# EAGLE design L298N MOTOR SÜRÜCÜ (EAGLE 9.6.2)
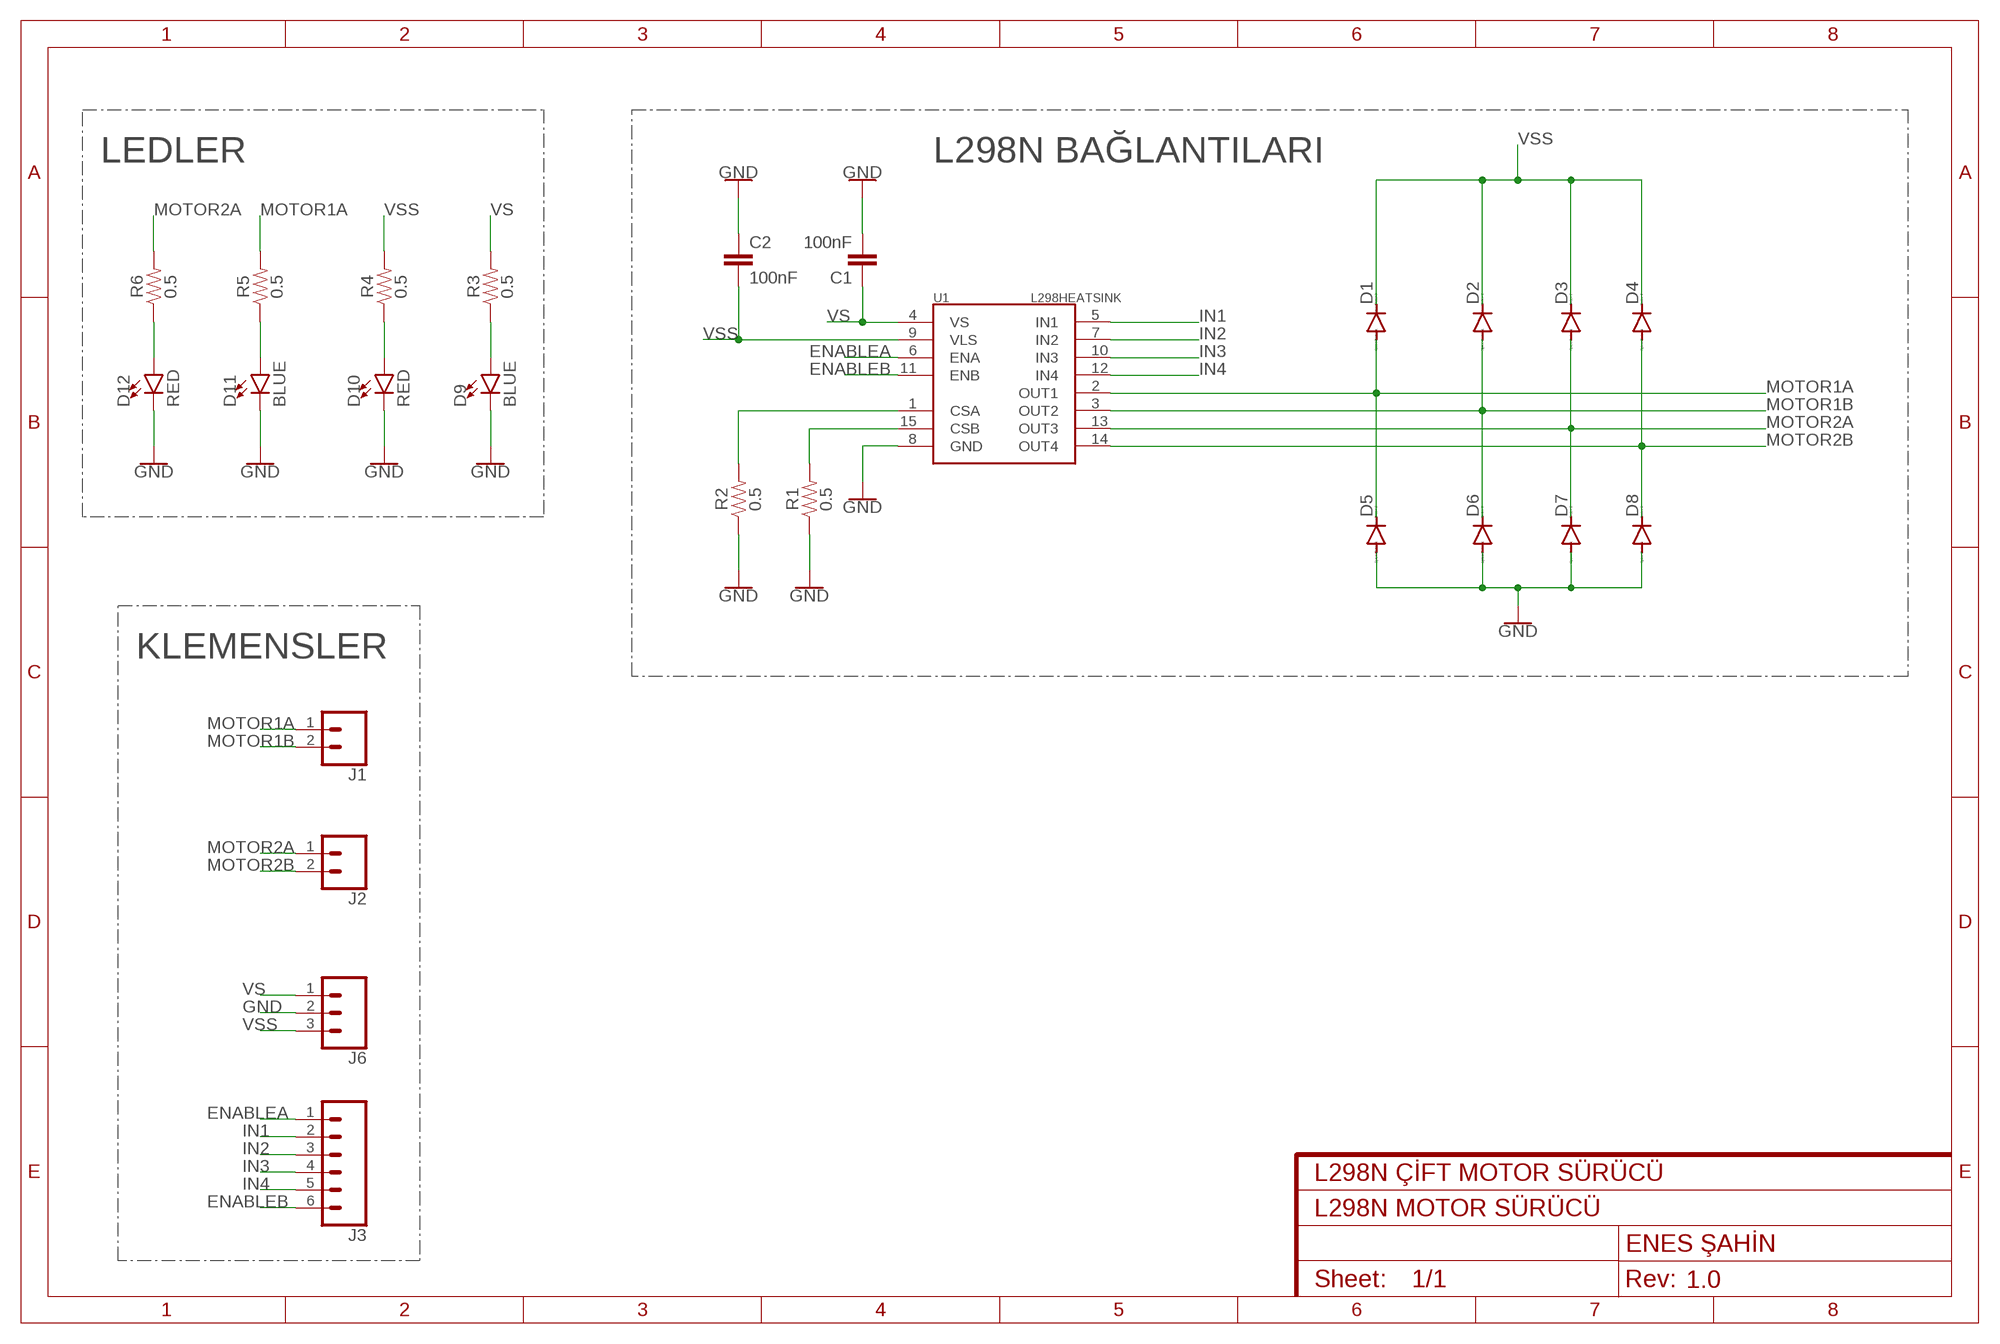
[diagram p0: schematic, sheet 1]
FRAME1 (FRAME-A4L): CNAME: L298N ÇİFT MOTOR SÜRÜCÜ; CREVISION: 1.0; DESIGNER: ENES ŞAHİN

## Parts
C1  100nF  10NF-0603-50V-10%  [0603]
C2  100nF  10NF-0603-50V-10%  [0603]
D1  CGRM4007-G  [SOD-123_MINI-SMA]
D2  CGRM4007-G  [SOD-123_MINI-SMA]
D3  CGRM4007-G  [SOD-123_MINI-SMA]
D4  CGRM4007-G  [SOD-123_MINI-SMA]
D5  CGRM4007-G  [SOD-123_MINI-SMA]
D6  CGRM4007-G  [SOD-123_MINI-SMA]
D7  CGRM4007-G  [SOD-123_MINI-SMA]
D8  CGRM4007-G  [SOD-123_MINI-SMA]
D9  BLUE  LED-BLUE0603  [LED-0603]
D10  RED  LED-RED0603  [LED-0603]
D11  BLUE  LED-BLUE0603  [LED-0603]
D12  RED  LED-RED0603  [LED-0603]
J1  CONN_02  [1X02]
J2  CONN_02  [1X02]
J3  CONN_06SILK_FEMALE_PTH  [1X06]
J6  CONN_03  [1X03]
R1  0.5  0.05OHM-0603-1/5W-1%  [0603]
R2  0.5  0.05OHM-0603-1/5W-1%  [0603]
R3  0.5  0.05OHM-0603-1/5W-1%  [0603]
R4  0.5  0.05OHM-0603-1/5W-1%  [0603]
R5  0.5  0.05OHM-0603-1/5W-1%  [0603]
R6  0.5  0.05OHM-0603-1/5W-1%  [0603]
U1  L298HEATSINK  [MULTIWATT15_6400BGHEATSINK]

## Nets
ENABLEA: J3.1 U1.6(ENA)
ENABLEB: J3.6 U1.11(ENB)
GND: C1.2 C2.1 D5.A D6.A D7.A D8.A D9.C D10.C D11.C D12.C J6.2 R1.1 R2.1 U1.8(GND)
IN1: J3.2 U1.5(IN1)
IN2: J3.3 U1.7(IN2)
IN3: J3.4 U1.10(IN3)
IN4: J3.5 U1.12(IN4)
MOTOR1A: D1.A D5.C J1.1 R5.2 U1.2(OUT1)
MOTOR1B: D2.A D6.C J1.2 U1.3(OUT2)
MOTOR2A: D3.A D7.C J2.1 R6.2 U1.13(OUT3)
MOTOR2B: D4.A D8.C J2.2 U1.14(OUT4)
N$1: R1.2 U1.15(CSB)
N$2: R2.2 U1.1(CSA)
N$3: D10.A R4.1
N$4: D9.A R3.1
N$5: D12.A R6.1
N$6: D11.A R5.1
VS: C1.1 J6.1 R3.2 U1.4(VS)
VSS: C2.2 D1.C D2.C D3.C D4.C J6.3 R4.2 U1.9(VLS)

## Notes on the sheet
- LEDLER | L298N BAĞLANTILARI
- KLEMENSLER

## Library data of the parts
C1 C2 = SparkFun-Capacitors:10NF: 0.01uF/10nF/10,000pF ceramic capacitors A capacitor is a passive two-terminal electrical component used to store electrical energy temporarily in an electric field. CAP-09321; PROD_ID: CAP-00867; VALUE: 10nF
D1-D8 = diode:CGRM400*-G: Molded plasitc,JEDEC SOD-123/Mini SMA Source: Comchip CGRM4001-G.pdf
D9 D11 = SparkFun-LED:LED-BLUE: Blue SMD LED Used in manufacturing of various products at SparkFun Packages: 0603 - SMD 0603 package [Product Link] <http://www.digikey.com/product-detail/en/SMLE12BC7TT86/511-1589-2-ND/1641808> 1206 - SMD1206 package [Product Link] <http://www.digikey.com/product-detail/en/lite-on-inc/LTST-C150TBKT/160-1643-1-ND/573584> SparkFun Products: ESP8266 Thing-Dev Board <https://www.sparkfun.com/products/13711> RedBoard <https://www.sparkfun.com/products/12757>; PROD_ID: DIO-08575
D10 D12 = SparkFun-LED:LED-RED: Red SMD LED Used in manufacturing of most products at SparkFun Packages: 0603 - SMD 0603 package [Product Link] <http://docs.avagotech.com/docs/AV02-0551EN> 0603 SMART - SMD 0603 SMART package ( more efficient and expensive)[Product Link] <http://www.osram-os.com/Graphics/XPic2/00077099_0.pdf> 1206 - SMD1206 package [Product Link] <https://www.sparkfun.com/datasheets/DevTools/LilyPad/Q150OVS4.pdff> SparkFun Products: Pro Mini 328 -5V <https://www.sparkfun.com/products/821> RedBoard <https://www.sparkfun.com/products/12757> IOIO-OTG <https://www.sparkfun.com/products/13613>; PROD_ID: DIO-00819
J1 J2 = SparkFun-Connectors:CONN_02: Multi connection point. Often used as Generic Header-pin footprint for 0.1 inch spaced/style header connections On any of the 0.1 inch spaced packages, you can populate with these: Break Away Headers - Straight <https://www.sparkfun.com/products/116> (PRT-00116) Break Away Male Headers - Right Angle <https://www.sparkfun.com/products/553> (PRT-00553) Female Headers <https://www.sparkfun.com/products/115> (PRT-00115) Break Away Headers - Machine Pin <https://www.sparkfun.com/products/117> (PRT-00117) Break Away Female Headers - Swiss Machine Pin <https://www.sparkfun.com/products/743> (PRT-00743) For SCREWTERMINALS and SPRING TERMINALS visit here: Screw Terimnals on SparkFun.com <https://www.sparkfun.com/search/results?term=Screw+Terminals> (5mm/3.5mm/2.54mm spacing) This device is also useful as a general connection point to wire up your design to another part of your project. Our various solder wires solder well into these plated through hole pads. Hook-Up Wire - Assortment (Stranded, 22 AWG) <https://www.sparkfun.com/products/11375> (PRT-11375) Hook-Up Wire - Assortment (Solid Core, 22 AWG) <https://www.sparkfun.com/products/11367> (PRT-11367) View the entire wire category on our website here <https://www.sparkfun.com/categories/141> Special notes: Molex polarized connector foot print use with: PRT-08233 with associated crimp pins and housings. 2.54_SCREWTERM for use with PRT-10571. 3.5mm Screw Terminal footprints for PRT-08084 5mm Screw Terminal footprints for use with PRT-08432
J3 = SparkFun-Connectors:CONN_06: Multi connection point. Often used as Generic Header-pin footprint for 0.1 inch spaced/style header connections On any of the 0.1 inch spaced packages, you can populate with these: Break Away Headers - Straight <https://www.sparkfun.com/products/116> (PRT-00116) Break Away Male Headers - Right Angle <https://www.sparkfun.com/products/553> (PRT-00553) Female Headers <https://www.sparkfun.com/products/115> (PRT-00115) Break Away Headers - Machine Pin <https://www.sparkfun.com/products/117> (PRT-00117) Break Away Female Headers - Swiss Machine Pin <https://www.sparkfun.com/products/743> (PRT-00743) Arduino Stackable Header - 6 Pin <https://www.sparkfun.com/products/9280> (PRT-09280) For SCREWTERMINALS and SPRING TERMINALS visit here: Screw Terimnals on SparkFun.com <https://www.sparkfun.com/search/results?term=Screw+Terminals> (5mm/3.5mm/2.54mm spacing) This device is also useful as a general connection point to wire up your design to another part of your project. Our various solder wires solder well into these plated through hole pads. Hook-Up Wire - Assortment (Stranded, 22 AWG) <https://www.sparkfun.com/products/11375> (PRT-11375) Hook-Up Wire - Assortment (Solid Core, 22 AWG) <https://www.sparkfun.com/products/11367> (PRT-11367) View the entire wire category on our website here <https://www.sparkfun.com/categories/141>; PROD_ID: CONN-08437
J6 = SparkFun-Connectors:CONN_03: Multi connection point. Often used as Generic Header-pin footprint for 0.1 inch spaced/style header connections On any of the 0.1 inch spaced packages, you can populate with these: Break Away Headers - Straight <https://www.sparkfun.com/products/116> (PRT-00116) Break Away Male Headers - Right Angle <https://www.sparkfun.com/products/553> (PRT-00553) Female Headers <https://www.sparkfun.com/products/115> (PRT-00115) Break Away Headers - Machine Pin <https://www.sparkfun.com/products/117> (PRT-00117) Break Away Female Headers - Swiss Machine Pin <https://www.sparkfun.com/products/743> (PRT-00743) Stackable Header - 3 Pin (Female, 0.1") <https://www.sparkfun.com/products/13875> (PRT-13875) For SCREWTERMINALS and SPRING TERMINALS visit here: Screw Terimnals on SparkFun.com <https://www.sparkfun.com/search/results?term=Screw+Terminals> (5mm/3.5mm/2.54mm spacing) This device is also useful as a general connection point to wire up your design to another part of your project. Our various solder wires solder well into these plated through hole pads. Hook-Up Wire - Assortment (Stranded, 22 AWG) <https://www.sparkfun.com/products/11375> (PRT-11375) Hook-Up Wire - Assortment (Solid Core, 22 AWG) <https://www.sparkfun.com/products/11367> (PRT-11367) View the entire wire category on our website here <https://www.sparkfun.com/categories/141> Special notes: Molex polarized connector foot print use with SKU : PRT-08232 with associated crimp pins and housings.
R1-R6 = SparkFun-Resistors:0.05OHM: 0.05Ω resistor A resistor is a passive two-terminal electrical component that implements electrical resistance as a circuit element. Resistors act to reduce current flow, and, at the same time, act to lower voltage levels within circuits. - Wikipedia; PROD_ID: RES-12535; VALUE: 0.05
U1 = SparkFun-IC-Special-Function:L298: L298 Dual Full Bridge Driver

## Board
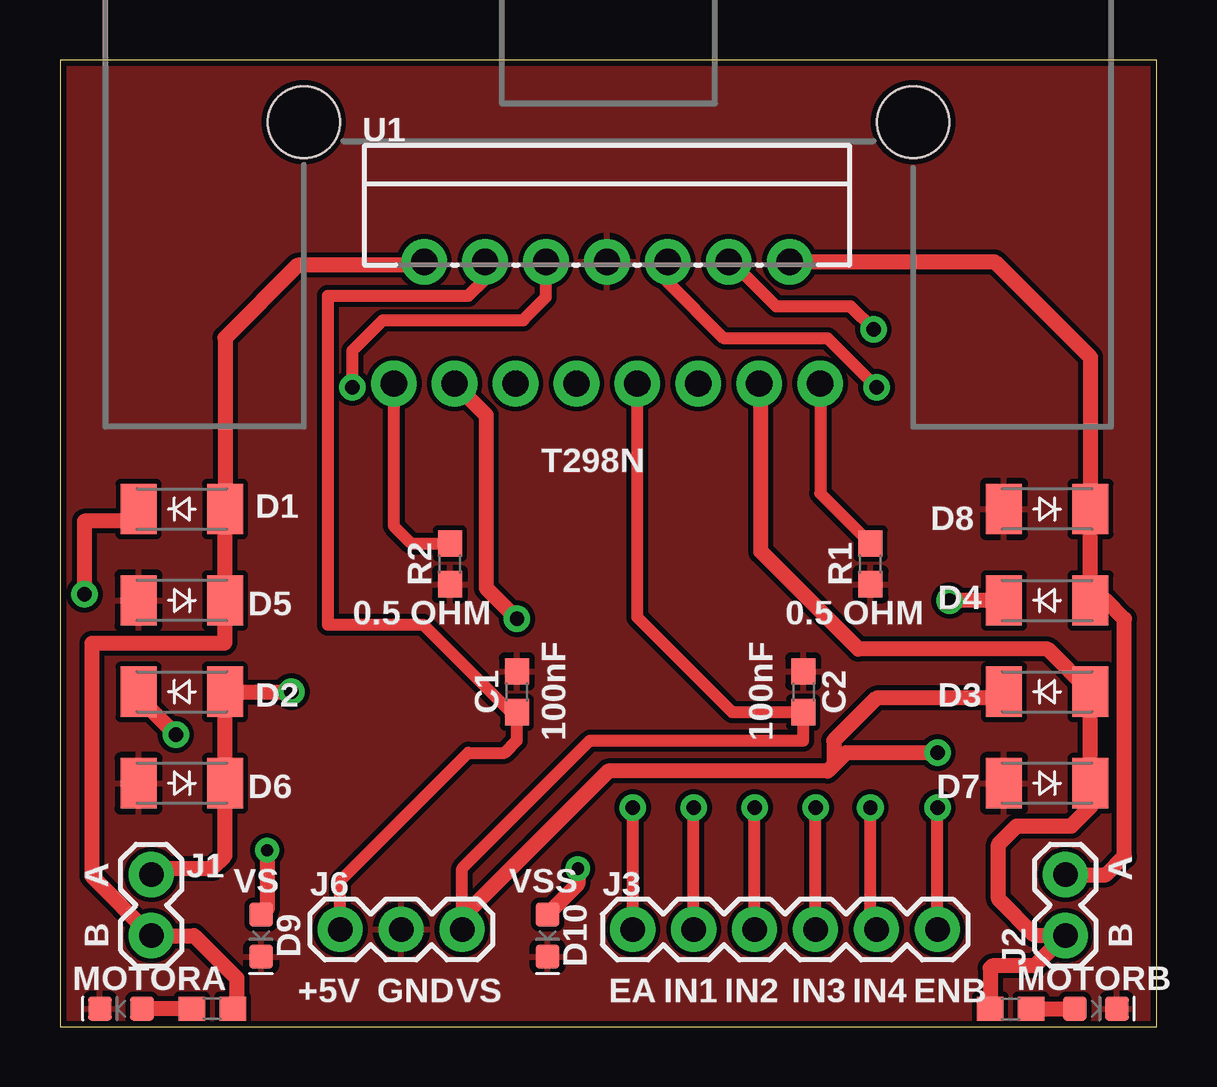
[diagram p1: board, top side]
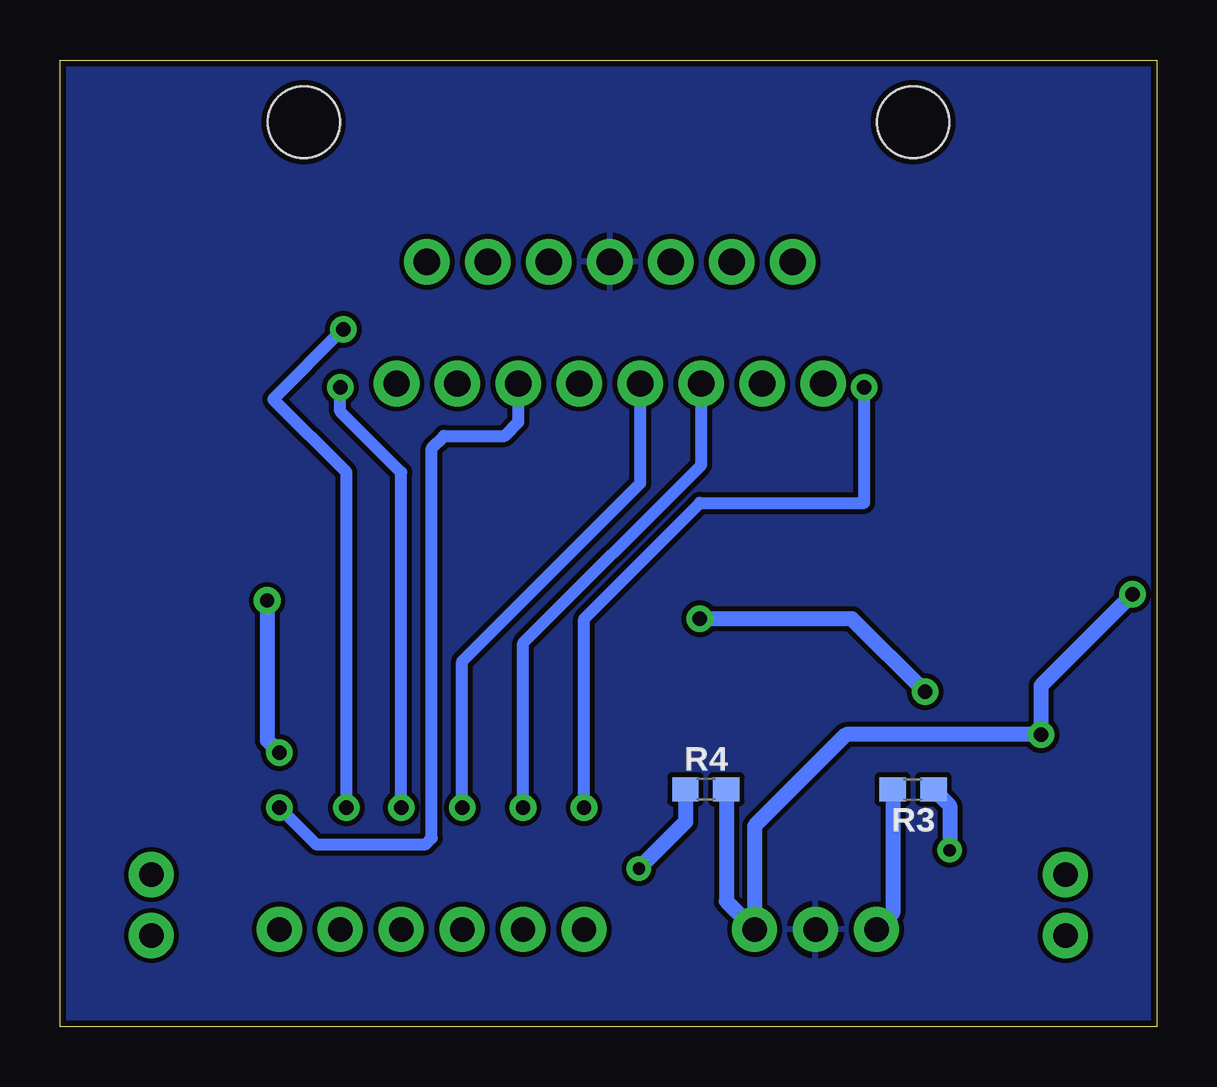
[diagram p2: board, bottom side, seen from below]

Size 45.72 x 40.31 mm. Coordinates in mm from the lower left corner, seen from the top.
Outline: 45.72,0 45.72,40.31 0,40.31 0,0 45.72,0
Copper layers (1*16): Top 0.035mm / dielectric 1.5mm / Bottom 0.035mm
Design rules "SparkFun": minimum track width 8mil, minimum drill 20mil, track to track 8mil, track to pad 8mil, pad to pad 8mil, via to via 8mil, smd to smd 8mil, copper to edge 10mil, drill to drill 8mil, minimum pad ring 12mil, minimum via ring 10mil, stop-mask expansion 4mil, vias tented up to drill 25mil, thermal gap 10mil

### Footprints (pad centres in the part's own frame; a part is rotated, then mirrored left to right if it is on the bottom)
0603 = smd 1.1 x 1: 1 -0.85,0; 2 0.85,0
SOD-123_MINI-SMA = smd 1.5 x 2.1: A 1.8,0; C -1.8,0
LED-0603 = smd 1 x 1: A -0.877,0; C 0.877,0
1X02 = drill 1.016 pad 1.88: 1 0,0; 2 2.54,0
1X06 = drill 1.016 pad 1.88: 1 0,0; 2 2.54,0; 3 5.08,0; 4 7.62,0; 5 10.16,0; 6 12.7,0
1X03 = drill 1.016 pad 1.88: 1 0,0; 2 2.54,0; 3 5.08,0
MULTIWATT15_6400BGHEATSINK = drill 1.1 pad 1.9: 1 -8.95,-2.39; 2 -7.68,2.69; 3 -6.41,-2.39; 4 -5.14,2.69; 5 -3.87,-2.39; 6 -2.6,2.69; 7 -1.33,-2.39; 8 -0.06,2.69; 9 1.21,-2.39; 10 2.48,2.69; 11 3.75,-2.39; 12 5.02,2.69; 13 6.29,-2.39; 14 7.56,2.69; 15 8.83,-2.39 | hole 2.997: -12.7,8.509; 12.7,8.509

### Placement (x,y rotation side)
C1  19.05,13.97 90 top
C2  30.99,13.97 270 top
D1  5.08,21.59 0 top
D2  5.08,13.97 0 top
D3  41.15,13.97 0 top
D4  41.15,17.78 0 top
D5  5.08,17.78 180 top
D6  5.08,10.16 180 top
D7  41.15,10.16 180 top
D8  41.15,21.59 180 top
D9  8.38,3.81 270 top
D10  20.32,3.81 270 top
D11  2.54,0.76 180 top
D12  43.18,0.76 0 top
J1  3.81,3.81 90 top
J2  41.91,3.81 90 top
J3  23.88,4.06 0 top
J6  11.68,4.06 0 top
R1  33.78,19.3 90 top
R2  16.26,19.3 90 top
R3  10.16,9.91 180 bottom
R4  18.8,9.91 0 bottom
R5  6.35,0.76 0 top
R6  39.62,0.76 180 top
U1  22.86,29.21 0 top

### Tracks (layer width: path | path; a pad name or v marks a point on that pad's centre or on a via)
ENABLEA  (via drill 0.6)
  Top 0.508: J3.1 v23.88,9.14 | v12.19,26.67 12.19,28.19 13.46,29.46 19.3,29.46 20.26,30.42 U1.6
  Bottom 0.508: v23.88,9.14 23.88,17.02 19.05,21.84 12.19,21.84 v12.19,26.67
ENABLEB  (via drill 0.6)
  Top 0.508: J3.6 v36.58,9.14
  Bottom 0.508: v36.58,9.14 35.05,7.62 30.48,7.62 30.23,7.87 30.23,24.13 29.72,24.64 27.18,24.64 26.61,25.21 U1.11
GND
  pour Top: 0,41.91 46.99,41.91 46.99,-1.27 -1.27,-1.27 -1.27,41.91
  pour Bottom: -1.27,43.18 46.99,43.18 48.26,43.18 48.26,-2.54 -2.54,-2.54 -2.54,43.18
IN1  (via drill 0.6)
  Top 0.508: J3.2 v26.42,9.14
  Bottom 0.508: v26.42,9.14 26.42,16 18.99,23.43 U1.5
IN2  (via drill 0.6)
  Top 0.508: J3.3 v28.96,9.14
  Bottom 0.508: v28.96,9.14 28.96,15.24 21.53,22.67 U1.7
IN3  (via drill 0.6)
  Top 0.508: J3.4 v31.5,9.14 | v34.04,26.67 32,28.7 27.69,28.7 25.34,31.05 U1.10
  Bottom 0.508: v31.5,9.14 31.5,23.11 34.04,25.65 v34.04,26.67
IN4  (via drill 0.6)
  Top 0.508: J3.5 33.78,4.32 v33.78,9.14 | v33.91,29.08 32.96,30.04 29.86,30.04 27.99,31.9 U1.12
  Bottom 0.508: v33.78,9.14 33.78,23.11 36.83,26.16 v33.91,29.08
MOTOR1A
  Top 0.635: U1.2 15.03,31.75 9.91,31.75 6.88,28.72 D1.A D5.C 6.88,16.02 6.86,16 1.33,16 1.33,6.29 J1.1 5.59,3.81 7.37,2.03 7.37,0.93 R5.2
MOTOR1B  (via drill 0.6)
  Top 0.635: v9.65,13.97 D2.A D6.C 6.88,7.13 6.35,6.6 4.06,6.6 J1.2 | v19.05,17.02 17.78,18.29 17.78,25.49 U1.3
  Bottom 0.635: v9.65,13.97 12.7,17.02 v19.05,17.02
MOTOR2A
  Top 0.635: U1.13 29.21,26.76 29.21,19.81 33.27,15.75 41.17,15.75 D3.A D7.C 42.95,9.17 42.16,8.38 39.88,8.38 39.12,7.62 39.12,5.33 40.64,3.81 J2.1 40.64,2.54 38.86,2.54 38.77,2.45 R6.2
MOTOR2B
  Top 0.635: U1.14 38.97,31.9 42.95,27.92 D8.C D4.A 43.61,17.78 44.37,17.02 44.37,7.11 43.61,6.35 J2.2
N$1
  Top 0.508: U1.15 31.69,22.25 R1.2
N$2
  Top 0.508: U1.1 13.91,20.89 14.64,20.15 R2.2
N$3  (via drill 0.51)
  Top 0.635: v21.59,6.6 21.59,5.96 D10.A
  Bottom 0.635: R4.1 19.65,8.55 v21.59,6.6
N$4  (via drill 0.51)
  Top 0.635: v8.64,7.37 8.64,4.94 D9.A
  Bottom 0.635: R3.1 8.64,9.23 v8.64,7.37
N$5
  Top 0.635: R6.1 D12.A
N$6
  Top 0.635: R5.1 D11.A
VS
  Top 0.508: J6.1 11.68,6.1 17.02,11.43 18.54,11.43 19.05,11.94 C1.1 18.8,13.12 15.15,16.76 11.18,16.76 11.18,30.48 17.02,30.48 17.72,31.18 U1.4
  Bottom 0.635: R3.2 11.01,4.74 J6.1
VSS  (via drill 0.6)
  Top 0.508: J6.3 16.76,6.6 22.1,11.94 30.99,11.94 C2.2 28.03,13.12 24.07,17.08 U1.9
  Top 0.635: D1.C 2.77,21.08 1.02,21.08 v1.02,18.03 | D2.C 3.28,13.74 v4.83,12.19 | D3.C 39.09,13.72 34.04,13.72 32.26,11.94 32.26,10.92 | 32.26,10.92 32,10.67 22.86,10.67 16.76,4.57 J6.3 | D4.C v37.08,17.78 | v36.58,11.43 32.77,11.43 32.26,10.92
  Bottom 0.635: v1.02,18.03 4.83,14.22 v4.83,12.19 12.95,12.19 16.76,8.38 J6.3 17.95,5.25 R4.2 | v37.08,17.78 37.08,11.94 v36.58,11.43

### Text on the board
tNames: T298N | 0.5 OHM | 0.5 OHM | 100nF | 100nF | A | VS | VSS | A | B | B | MOTORA | +5V | GND | VS | EA | IN1 | IN2 | IN3 | IN4 | ENB | MOTORB